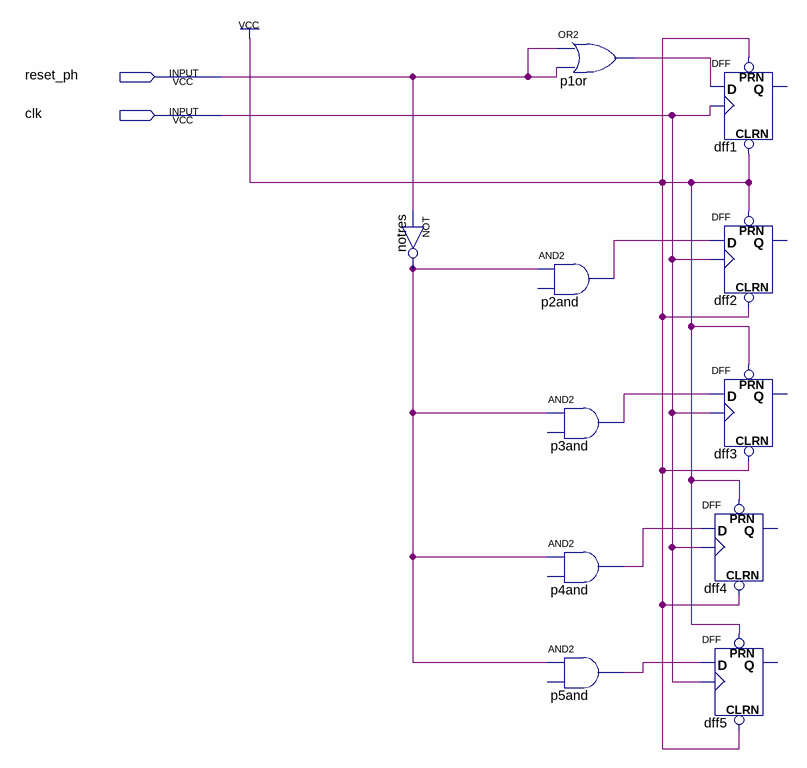
[diagram p0: schematic sheet]
// Quartus schematic phazecounter.bdf as structural Verilog: 11 symbols, 2 pins
module phazecounter (
  input  reset_ph,
  input  clk
);

  wire notres_out, p1or_out, p2and_out, p3and_out, p4and_out, p5and_out;

  not notres (notres_out, reset_ph);
  or p1or (p1or_out, reset_ph, reset_ph);
  buf p2and (p2and_out, notres_out);  // AND2 open: IN2
  buf p3and (p3and_out, notres_out);  // AND2 open: IN2
  buf p4and (p4and_out, notres_out);  // AND2 open: IN2
  buf p5and (p5and_out, notres_out);  // AND2 open: IN2
  DFF dff1 (.CLRN(1'b1), .CLK(clk), .D(p1or_out), .PRN(1'b1));  // open: Q
  DFF dff2 (.CLRN(1'b1), .CLK(clk), .D(p2and_out), .PRN(1'b1));  // open: Q
  DFF dff3 (.CLRN(1'b1), .CLK(clk), .D(p3and_out), .PRN(1'b1));  // open: Q
  DFF dff4 (.CLRN(1'b1), .CLK(clk), .D(p4and_out), .PRN(1'b1));  // open: Q
  DFF dff5 (.CLRN(1'b1), .CLK(clk), .D(p5and_out), .PRN(1'b1));  // open: Q
endmodule
